# Altium schematic sheet OLED_E_paper.SchDoc
size Letter
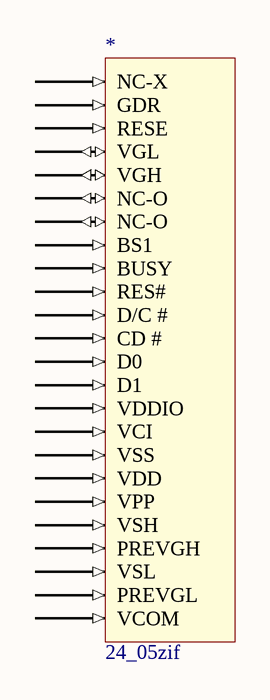
[diagram p0: OLED_E_paper.SchDoc]

## Parts
*  24_05zif  [24 pin 0.5mm zif]

## Nets

Not connected (* = marked no-connect by the designer): * 1(NC-X) 2(GDR) 3(RESE) 4(VGL) 5(VGH) 6(NC-O) 7(NC-O) 8(BS1) 9(BUSY) 10(RES#) 11(D/C_#) 12(CD_#) 13(D0) 14(D1) 15(VDDIO) 16(VCI) 17(VSS) 18(VDD) 19(VPP) 20(VSH) 21(PREVGH) 22(VSL) 23(PREVGL) 24(VCOM)

## Library data of the parts
* = 24_05zif: 0.5mm pitch 24 position zif connector epaper